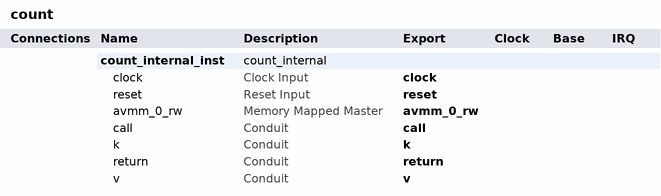
[diagram p0: system contents]
# Platform Designer (Qsys) system count, Arria 10 10AX115U1F45I1SG
# Parameters at their usual value, and those the tool derives, are not listed.
package require qsys
create_system count
set_project_property DEVICE_FAMILY {Arria 10}
set_project_property DEVICE 10AX115U1F45I1SG

add_instance count_internal_inst count_internal 1.0
set_instance_property count_internal_inst AUTO_EXPORT true

# exported interfaces
add_interface avmm_0_rw avalon master
set_interface_property avmm_0_rw EXPORT_OF count_internal_inst.avmm_0_rw
add_interface call conduit end
set_interface_property call EXPORT_OF count_internal_inst.call
add_interface clock clock sink
set_interface_property clock EXPORT_OF count_internal_inst.clock
add_interface k conduit end
set_interface_property k EXPORT_OF count_internal_inst.k
add_interface reset reset sink
set_interface_property reset EXPORT_OF count_internal_inst.reset
add_interface return conduit end
set_interface_property return EXPORT_OF count_internal_inst.return
add_interface v conduit end
set_interface_property v EXPORT_OF count_internal_inst.v

set_interconnect_requirement {$system} qsys_mm.clockCrossingAdapter HANDSHAKE
set_interconnect_requirement {$system} qsys_mm.enableEccProtection FALSE
set_interconnect_requirement {$system} qsys_mm.insertDefaultSlave FALSE
set_interconnect_requirement {$system} qsys_mm.maxAdditionalLatency 1

save_system count.qsys
